# Altium schematic sheet Sheet2.SchDoc
size A
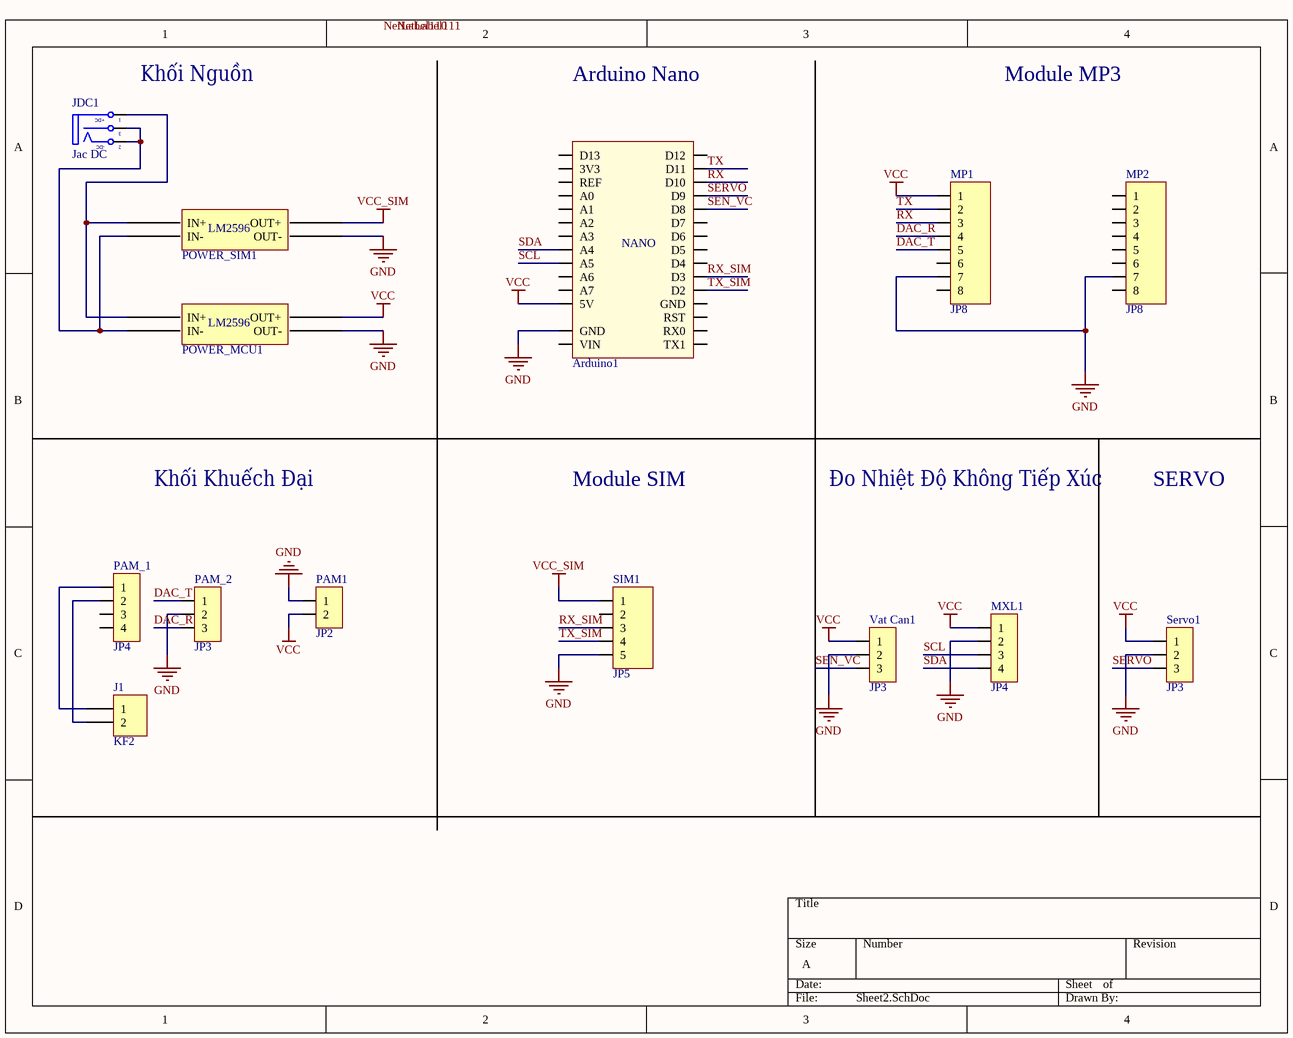
[diagram p0: Sheet2.SchDoc]

## Parts
Arduino1  Arduino Nano  [Arduino Nano]  (value not drawn)
J1  KF2  [KF2-3.5]
JDC1  Jac DC  [DC0]
MP1  JP8  [JP8-C1C]
MP2  JP8  [JP8-C1C]
MXL1  JP4  [JP4-C1T]
PAM1  JP2  [JP2-C1T]
PAM_1  JP4  [JP4-C1T]
PAM_2  JP3  [JP3-C1T]
POWER_MCU1  BUCK_LM2596  [BUCK_LM2596]  (value not drawn)
POWER_SIM1  BUCK_LM2596  [BUCK_LM2596]  (value not drawn)
Servo1  JP3  [JP3-C1T]
SIM1  JP5  [JP5-C1T]
Vat_Can1  JP3  [JP3-C1T]

## Nets
GND: Arduino1.GND MP1.7 MP2.7 MXL1.2 PAM1.1 PAM_2.2 POWER_MCU1.3(OUT-) POWER_SIM1.3(OUT-) Servo1.2 SIM1.5 Vat_Can1.2
VCC: Arduino1.5V MP1.1 MXL1.1 PAM1.2 POWER_MCU1.4(OUT+) Servo1.1 Vat_Can1.1
VCC_SIM: POWER_SIM1.4(OUT+) SIM1.1
DAC_R: MP1.4 PAM_2.3
DAC_T: MP1.5 PAM_2.1
RX: Arduino1.D10 MP1.3
RX_SIM: Arduino1.D3 SIM1.3
SCL: Arduino1.A5 MXL1.3
SDA: Arduino1.A4 MXL1.4
SEN_VC: Arduino1.D8 Vat_Can1.3
SERVO: Arduino1.D9 Servo1.3
TX: Arduino1.D11 MP1.2
TX_SIM: Arduino1.D2 SIM1.4
NetJ1_1: J1.1 PAM_1.1
NetJ1_2: J1.2 PAM_1.2
NetJDC1_1: JDC1.1(T) POWER_MCU1.1(IN+) POWER_SIM1.1(IN+)
NetJDC1_2: JDC1.2(TN) JDC1.3(S) POWER_MCU1.2(IN-) POWER_SIM1.2(IN-)

Not connected (* = marked no-connect by the designer): Arduino1 3V3 A0 A1 A2 A3 A6 A7 D4 D5 D6 D7 D12 D13 REF RST RX0 TX1 VIN; MP1 6 8; MP2 1 2 3 4 5 6 8; PAM_1 3 4; SIM1 2

## Notes on the sheet
- (near JDC1) Khối Nguồn
- Arduino Nano
- Module MP3
- Khối Khuếch Đại
- Module SIM
- Đo Nhiệt Độ Không Tiếp Xúc
- SERVO
- Labels drawn without touching a wire or pin: NetLabel110, NetLabel111
- (in symbol Arduino Nano) NANO
- (in symbol BUCK_LM2596) LM2596
- (in symbol DCIN) +DC; -DC

## Library data of the parts
Arduino1 = Arduino Nano: Value: Cau 1A
J1 = KF2: Manufacturer: Würth Elektronik eiSos GmbH; partNo: 691103110002; ComponentLink1 Description: Manufacturer; ComponentLink2 Description: Datasheet; NoPins: 2; Created Date: 29 October 2013; ComponentLink1URL: http://www.we-online.com; ComponentLink2URL: http://katalog.we-online.de/em/datasheet/6911031100xx.pdf; Created by: Karrer Zheng
JDC1 = DCIN: Jac DC input; Value: Jac DC
MP1 MP2 = JP8: WR-PHD 2.54 mm Angled Socket Header; Manufacturer: W¨¹rth Elektronik eiSos GmbH; partNo: 613008143121; ComponentLink1 Description: Manufacturer; ComponentLink2 Description: Datasheet; NoPins: 08; Created Date: 29 March 2013; ComponentLink1URL: http://www.we-online.com; ComponentLink2URL: http://katalog.we-online.de/em/datasheet/6130xx143121.pdf; Created by: Karrer Zheng
MXL1 PAM_1 = JP4: WR-PHD 2.54 mm Angled Socket Header; Manufacturer: W¨¹rth Elektronik eiSos GmbH; partNo: 613004143121; ComponentLink1 Description: Manufacturer; ComponentLink2 Description: Datasheet; NoPins: 04; Created Date: 29 March 2013; ComponentLink1URL: http://www.we-online.com; ComponentLink2URL: http://katalog.we-online.de/em/datasheet/6130xx143121.pdf; Created by: Karrer Zheng
PAM1 = JP2: WR-PHD 2.54 mm Angled Socket Header; Manufacturer: W¨¹rth Elektronik eiSos GmbH; partNo: 613002143121; ComponentLink1 Description: Manufacturer; ComponentLink2 Description: Datasheet; NoPins: 02; Created Date: 29 March 2013; ComponentLink1URL: http://www.we-online.com; ComponentLink2URL: http://katalog.we-online.de/em/datasheet/6130xx143121.pdf; Created by: Karrer Zheng
PAM_2 Servo1 Vat_Can1 = JP3: WR-PHD 2.54 mm Angled Socket Header; Manufacturer: W¨¹rth Elektronik eiSos GmbH; partNo: 613003143121; ComponentLink1 Description: Manufacturer; ComponentLink2 Description: Datasheet; NoPins: 03; Created Date: 29 March 2013; ComponentLink1URL: http://www.we-online.com; ComponentLink2URL: http://katalog.we-online.de/em/datasheet/6130xx143121.pdf; Created by: Karrer Zheng
SIM1 = JP5: WR-PHD 2.54 mm Angled Socket Header; Manufacturer: W¨¹rth Elektronik eiSos GmbH; partNo: 613005143121; ComponentLink1 Description: Manufacturer; ComponentLink2 Description: Datasheet; NoPins: 05; Created Date: 29 March 2013; ComponentLink1URL: http://www.we-online.com; ComponentLink2URL: http://katalog.we-online.de/em/datasheet/6130xx143121.pdf; Created by: Karrer Zheng